# Altium schematic sheet ScopeVideoOnly.SchDoc: CRT Video Amp and Focus/Astig
size Letter; Organization: ES; Revision: A; SheetNumber: 1; SheetTotal: 1
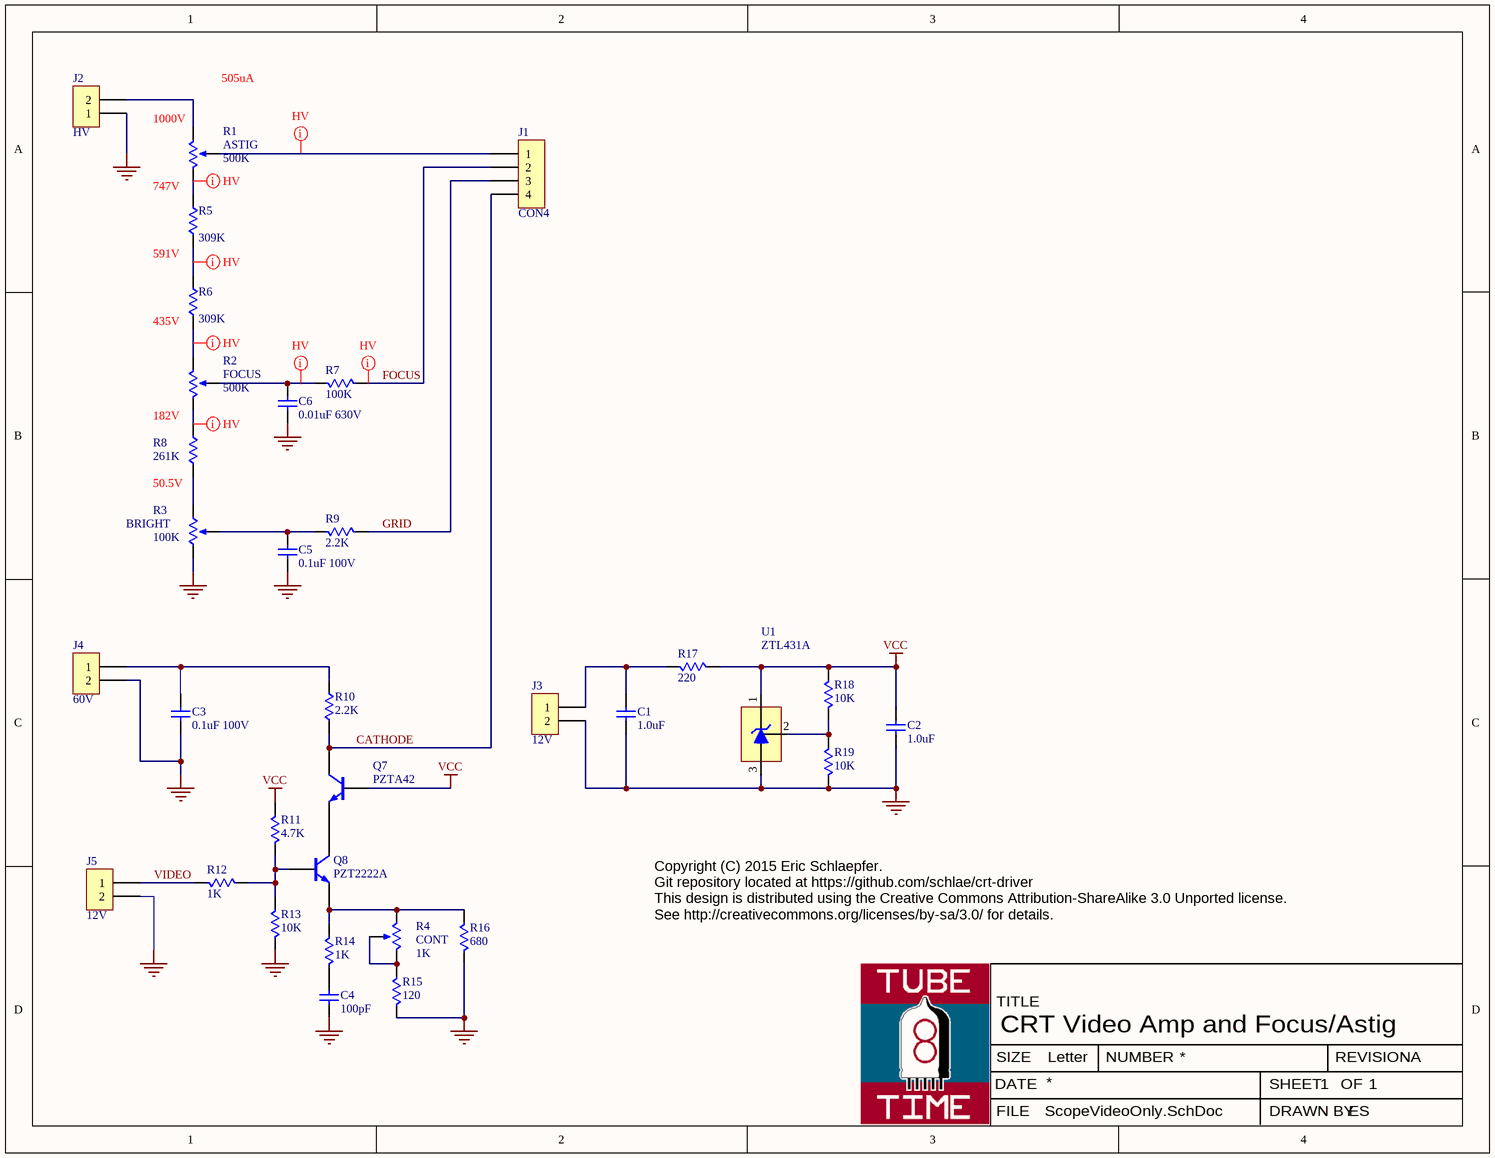
[diagram p0: ScopeVideoOnly.SchDoc]

## Parts
C1  value 1.0uF  [G_0805[2012]]  (hidden comment: Cap)
C2  value 1.0uF  [G_0805[2012]]  (hidden comment: Cap)
C3  value 0.1uF 100V  [G_1206[3216]]  (hidden comment: Cap)
C4  value 100pF  [G_0805[2012]]  (hidden comment: Cap)
C5  value 0.1uF 100V  [G_1206[3216]]  (hidden comment: Cap)
C6  value 0.01uF 630V  [G_1206[3216]]  (hidden comment: Cap)
J1  CON4  [HDR5S156M2]
J2  HV  [HDR3S156M1]
J3  12V  [HDR2S]
J4  60V  [HDR2S]
J5  12V  [HDR2S]
Q7  value PZTA42  [G_SOT223T]  (hidden comment: NPN)
Q8  value PZT2222A  [G_SOT223T]  (hidden comment: NPN)
R1  ASTIG  value 500K  [POT_TRIM BOURNS 3386F]
R2  FOCUS  value 500K  [POT_TRIM BOURNS 3386F]
R3  BRIGHT  value 100K  [POT_TRIM BOURNS 3386F]
R4  CONT  value 1K  [POT_TRIM BOURNS 3386F]
R5  value 309K  [G_1206[3216]]  (hidden comment: Res1)
R6  value 309K  [G_1206[3216]]  (hidden comment: Res1)
R7  value 100K  [G_0805[2012]]  (hidden comment: Res1)
R8  value 261K  [G_1206[3216]]  (hidden comment: Res1)
R9  value 2.2K  [G_0805[2012]]  (hidden comment: Res1)
R10  value 2.2K  [G_1206[3216]]  (hidden comment: Res1)
R11  value 4.7K  [G_0805[2012]]  (hidden comment: Res1)
R12  value 1K  [G_0805[2012]]  (hidden comment: Res1)
R13  value 10K  [G_0805[2012]]  (hidden comment: Res1)
R14  value 1K  [G_0805[2012]]  (hidden comment: Res1)
R15  value 120  [G_0805[2012]]  (hidden comment: Res1)
R16  value 680  [G_0805[2012]]  (hidden comment: Res1)
R17  value 220  [G_0805[2012]]  (hidden comment: Res1)
R18  value 10K  [G_0805[2012]]  (hidden comment: Res1)
R19  value 10K  [G_0805[2012]]  (hidden comment: Res1)
U1  ZTL431A  [G_SOT23]

## Nets
GND: C1.1 C2.1 C3.2 C4.2 C5.2 C6.2 J2.1 J3.2 J4.2 J5.2 R3.1(TOP) R13.2 R15.2 R16.2 R19.2 U1.3(A)
VCC: C2.2 Q7.B R11.1 R17.1 R18.1 U1.1(C)
CATHODE: J1.4 Q7.C R10.1
FOCUS: J1.2 R7.1
GRID: J1.3 R9.1
VIDEO: J5.1 R12.1
NetC1_2: C1.2 J3.1 R17.2
NetC3_1: C3.1 J4.1 R10.2
NetC4_1: C4.1 R14.2
NetC5_1: C5.1 R3.3(TAP) R9.2
NetC6_1: C6.1 R2.3(TAP) R7.2
NetJ1_1: J1.1 R1.3(TAP)
NetJ2_2: J2.2 R1.1(TOP)
NetQ7_E: Q7.E Q8.C
NetQ8_B: Q8.B R11.2 R12.2 R13.1
NetQ8_E: Q8.E R4.2(BOT) R14.1 R16.1
NetR1_2: R1.2(BOT) R5.2
NetR2_1: R2.1(TOP) R6.1
NetR2_2: R2.2(BOT) R8.2
NetR3_2: R3.2(BOT) R8.1
NetR4_1: R4.1(TOP) R4.3(TAP) R15.1
NetR5_1: R5.1 R6.2
NetR18_2: R18.2 R19.1 U1.2(REF)

## Layout directives
net class HV: FOCUS, NetC6_1, NetJ1_1, NetR1_2, NetR2_1, NetR2_2, NetR5_1

## Notes on the sheet
- 505uA
- (near R1) 1000V
- 747V
- 591V
- (near R6) 435V
- 182V
- 50.5V
- Copyright (C) 2015 Eric Schlaepfer.
  Git repository located at https://github.com/schlae/crt-driver
  This design is distributed using the Creative Commons Attribution-ShareAlike 3.0 Unported license.
  See http://creativecommons.org/licenses/by-sa/3.0/ for details.
- TITLE
- DATE
- SIZE
- Letter
- NUMBER
- SHEET
- REVISION
- OF
- FILE
- DRAWN BY

## Library data of the parts
C1 C2 = Cap: Capacitor; ManufPart: C2012X7R1E105K125AB; Mouser: 810-C2012X7R1E105K
C3-C6 = Cap: Capacitor
  C3 C5: Mouser: 810-C3216X7R2A104K
  C4: Mouser: 581-08055A101J
  C6: Mouser: 810-C3216X7R2J103K
J1 = CON4: Connector, 4 pin; Mouser: 538-26-48-1051
J2-J5 = CON2: Connector, 2 pin
  J2: Mouser: 538-26-48-1031
  J3-J5: Mouser: Part of J3
Q7 Q8 = NPN: NPN Bipolar Transistor
  Q7: ManufPart: PZTA42; Mouser: 512-PZTA42
  Q8: ManufPart: PZT2222A; Mouser: 512-PZT2222A
R1 R2 = Pot: Variable Resistor; ManufPart: 3386F-1-504LF; Mouser: 652-3386F-1-504LF
R3 = Pot: Variable Resistor; ManufPart: 3386F-1-104LF; Mouser: 652-3386F-1-104LF
R4 = Pot: Variable Resistor; ManufPart: 3386F-1-102LF; Mouser: 652-3386F-1-102LF
R5 R6 = Res: Resistor; ManufPart: ERJ-8ENF3093V; Mouser: 667-ERJ-8ENF3093V
R7 = Res: Resistor; ManufPart: CRCW0805100KFKEA; Mouser: 71-CRCW0805-100K-E3
R8 = Res: Resistor; ManufPart: CRCW1206261KFKEA; Mouser: 71-CRCW1206-261K-E3
R9 = Res: Resistor; ManufPart: ERJ-6ENF2201V; Mouser: 667-ERJ-6ENF2201V
R10 = Res: Resistor; ManufPart: CRCW12062K20FKEA; Mouser: 71-CRCW1206-2.2K-E3
R11 = Res: Resistor; ManufPart: CRCW08054K70FKEA; Mouser: 71-CRCW0805-4.7K-E3
R12 R14 = Res: Resistor; ManufPart: CRCW08051K00JNEA; Mouser: 71-CRCW0805J-1K-E3
R13 R18 R19 = Res: Resistor; ManufPart: CRCW080510K0FKEB; Mouser: 71-CRCW080510K0FKEB
R15 = Res: Resistor; ManufPart: CRCW0805120RFKEA; Mouser: 71-CRCW0805120RFKEA
R16 = Res: Resistor; ManufPart: CRCW0805680RFKEA; Mouser: 71-CRCW0805680RFKEA
R17 = Res: Resistor; ManufPart: CRCW0805220RFKEA; Mouser: 71-CRCW0805-220-E3
U1 = TL431: Adjustable Shunt Reg; ManufPart: ZTL431AFFTA; Mouser: 522-ZTL431AFTA